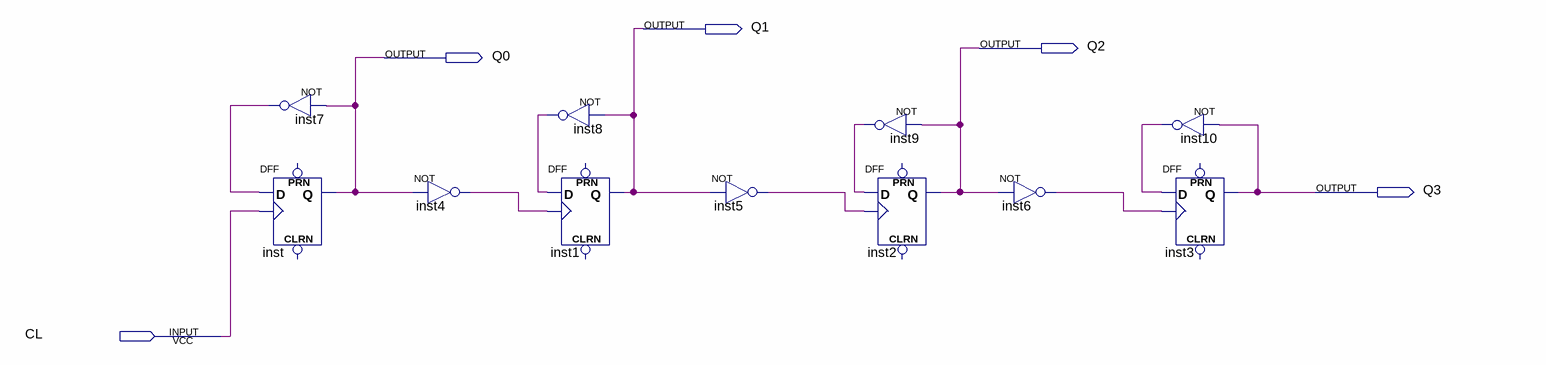
[diagram p0: schematic sheet]
// Quartus schematic async4.bdf as structural Verilog: 11 symbols, 5 pins
module async4 (
  input  CL,
  output Q1,
  output Q2,
  output Q0,
  output Q3
);

  wire inst4_out, inst5_out, inst6_out, inst7_out, inst8_out, inst9_out, inst10_out;

  not inst7 (inst7_out, Q0);
  DFF inst (.CLK(CL), .D(inst7_out), .Q(Q0));  // open: CLRN, PRN
  not inst4 (inst4_out, Q0);
  not inst8 (inst8_out, Q1);
  DFF inst1 (.CLK(inst4_out), .D(inst8_out), .Q(Q1));  // open: CLRN, PRN
  not inst5 (inst5_out, Q1);
  not inst9 (inst9_out, Q2);
  DFF inst2 (.CLK(inst5_out), .D(inst9_out), .Q(Q2));  // open: CLRN, PRN
  not inst6 (inst6_out, Q2);
  not inst10 (inst10_out, Q3);
  DFF inst3 (.CLK(inst6_out), .D(inst10_out), .Q(Q3));  // open: CLRN, PRN
endmodule
